# EAGLE schematic i2c-logic-level-converter (EAGLE 6.3)
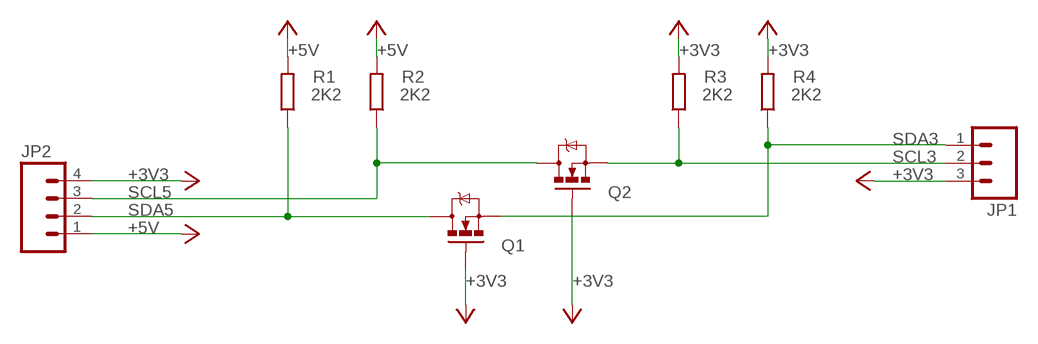
[diagram p0: schematic, sheet 1]

## Parts
JP1  M03PTH  [1X03]
JP2  M04PTH  [1X04]
Q1  MOSFET-NCHANNELPTH  [TO-92]
Q2  MOSFET-NCHANNELPTH  [TO-92]
R1  2K2  R-EU_0204/5  [0204/5]
R2  2K2  R-EU_0204/5  [0204/5]
R3  2K2  R-EU_0204/5  [0204/5]
R4  2K2  R-EU_0204/5  [0204/5]

## Nets
+3V3: JP1.3 JP2.4 Q1.3(G) Q2.3(G) R3.2 R4.2
+5V: JP2.1 R1.2 R2.2
SCL3: JP1.2 Q2.2(S) R3.1
SCL5: JP2.3 Q2.1(D) R2.1
SDA3: JP1.1 Q1.2(S) R4.1
SDA5: JP2.2 Q1.1(D) R1.1

## Library data of the parts
JP1 = SparkFun:M03: Header 3 Standard 3-pin 0.1" header. Use with straight break away headers (SKU : PRT-00116), right angle break away headers (PRT-00553), swiss pins (PRT-00743), machine pins (PRT-00117), and female headers (PRT-00115). Molex polarized connector foot print use with SKU : PRT-08232 with associated crimp pins and housings.
JP2 = SparkFun:M04: Header 4 Standard 4-pin 0.1" header. Use with straight break away headers (SKU : PRT-00116), right angle break away headers (PRT-00553), swiss pins (PRT-00743), machine pins (PRT-00117), and female headers (PRT-00115). Molex polarized connector foot print use with SKU : PRT-08231 with associated crimp pins and housings. 1MM SMD Version SKU: PRT-10208
Q1 Q2 = SparkFun:MOSFET-NCHANNEL
R1-R4 = resistor:R-EU_: RESISTOR, European symbol